# EAGLE schematic lcd1 (EAGLE 4.16)
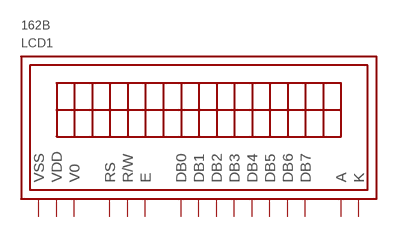
[diagram p0: schematic, sheet 1]

## Parts
LCD1  162B  [LCD_1]
Unconnected: LCD1.1(A) LCD1.2(K) LCD1.3(VSS) LCD1.4(VDD) LCD1.5(V0) LCD1.6(RS) LCD1.7(R/W) LCD1.8(E) LCD1.9(DB0) LCD1.10(DB1) LCD1.11(DB2) LCD1.12(DB3) LCD1.13(DB4) LCD1.14(DB5) LCD1.15(DB6) LCD1.16(DB7)

## Library data of the parts
LCD1 = lcd:162B: Display a cristalli liquidi tipo 162B Displaytech http://www.displaytech.com.hk/index.htm Source: http://www.fairchildsemi.com/ds/ML/ML4425.pdf